# Altium schematic sheet LPCB278 - RELAYS.SchDoc
size A3; Address1: Factory 10; Address2: 9-13 Dingley Avenue, Dandeong, VICTORIA 3175, AUSTRALIA; DocumentNumber: 4; Revision: 1; SheetNumber: 4; SheetTotal: 5; Lockie__PCB_SUB_ASSEMBLY: PCB Sub Component; Lockie__PCB_ASSEMBLY: PCB Assembly; Lockie__LDL: LPCB278; Lockie__PCB_DESCRIPTION: HE Thermal Module
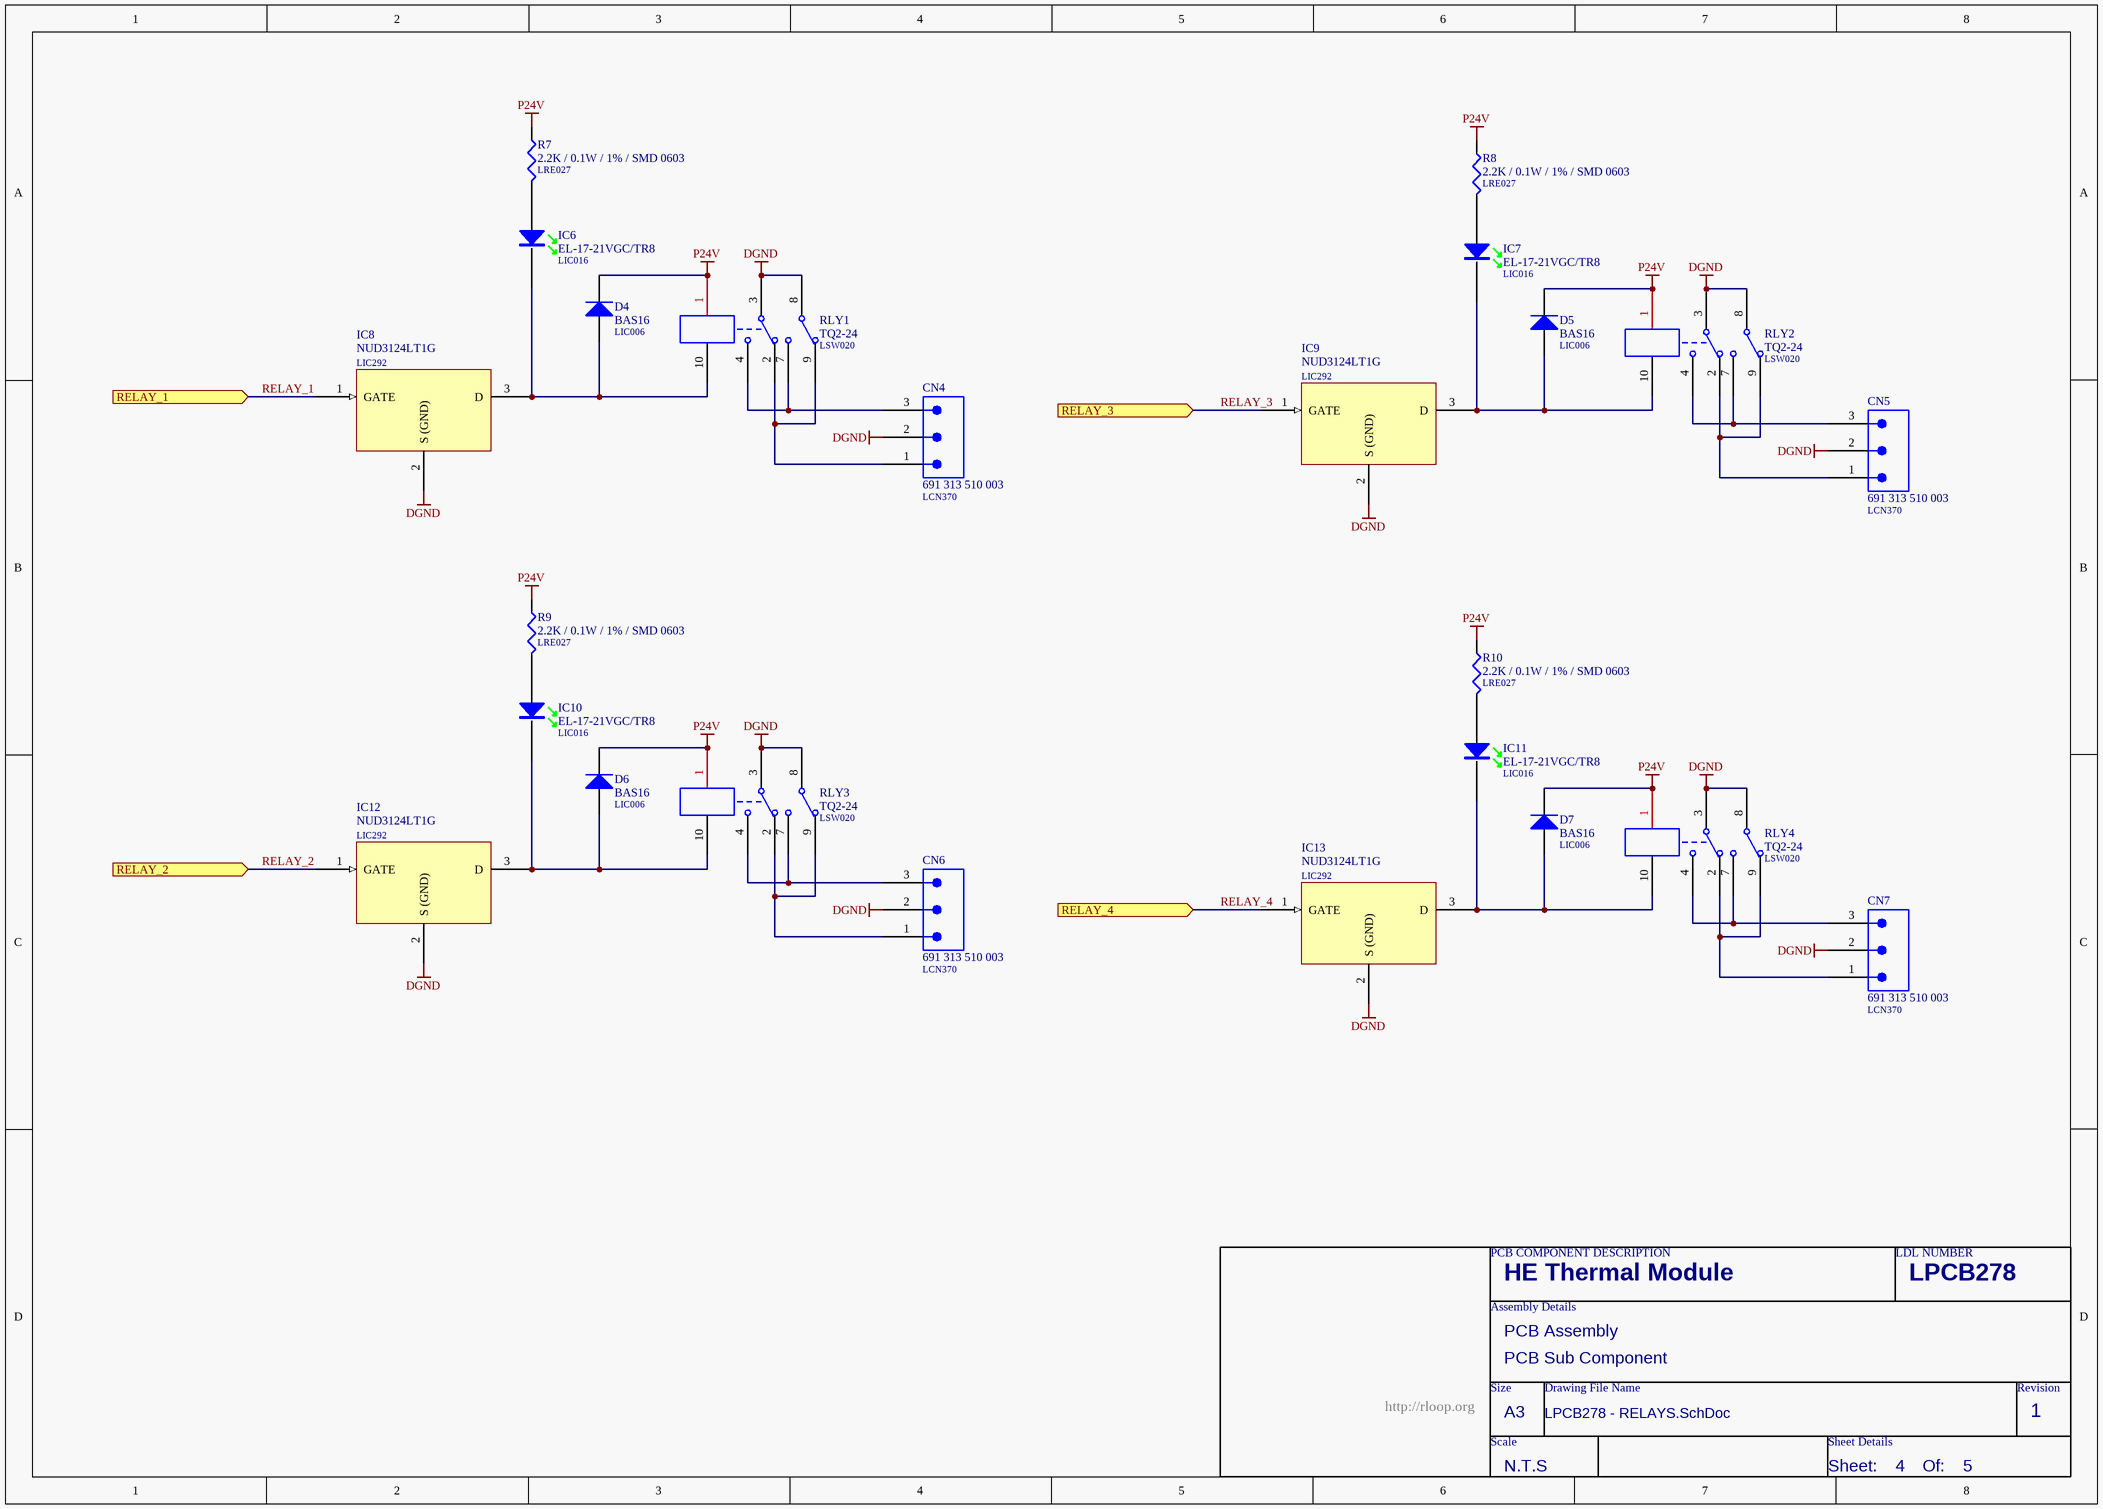
[diagram p0: LPCB278 - RELAYS.SchDoc]

## Parts
CN4  691 313 510 003  LDL_NUMBER: LCN370  [691 313 510 003]
CN5  691 313 510 003  LDL_NUMBER: LCN370  [691 313 510 003]
CN6  691 313 510 003  LDL_NUMBER: LCN370  [691 313 510 003]
CN7  691 313 510 003  LDL_NUMBER: LCN370  [691 313 510 003]
D4  BAS16  LDL_NUMBER: LIC006  [LFP021__SOT23]
D5  BAS16  LDL_NUMBER: LIC006  [LFP021__SOT23]
D6  BAS16  LDL_NUMBER: LIC006  [LFP021__SOT23]
D7  BAS16  LDL_NUMBER: LIC006  [LFP021__SOT23]
IC6  EL-17-21VGC/TR8  LDL_NUMBER: LIC016  [CR2012-0805-LED]
IC7  EL-17-21VGC/TR8  LDL_NUMBER: LIC016  [CR2012-0805-LED]
IC8  NUD3124LT1G  LDL_NUMBER: LIC292  [LFP021__SOT23]
IC9  NUD3124LT1G  LDL_NUMBER: LIC292  [LFP021__SOT23]
IC10  EL-17-21VGC/TR8  LDL_NUMBER: LIC016  [CR2012-0805-LED]
IC11  EL-17-21VGC/TR8  LDL_NUMBER: LIC016  [CR2012-0805-LED]
IC12  NUD3124LT1G  LDL_NUMBER: LIC292  [LFP021__SOT23]
IC13  NUD3124LT1G  LDL_NUMBER: LIC292  [LFP021__SOT23]
R7  2.2K / 0.1W / 1% / SMD 0603  LDL_NUMBER: LRE027  [LFP020__CR1608-0603-IPC7351_B]
R8  2.2K / 0.1W / 1% / SMD 0603  LDL_NUMBER: LRE027  [LFP020__CR1608-0603-IPC7351_B]
R9  2.2K / 0.1W / 1% / SMD 0603  LDL_NUMBER: LRE027  [LFP020__CR1608-0603-IPC7351_B]
R10  2.2K / 0.1W / 1% / SMD 0603  LDL_NUMBER: LRE027  [LFP020__CR1608-0603-IPC7351_B]
RLY1  TQ2-24  LDL_NUMBER: LSW020  [TQ2]
RLY2  TQ2-24  LDL_NUMBER: LSW020  [TQ2]
RLY3  TQ2-24  LDL_NUMBER: LSW020  [TQ2]
RLY4  TQ2-24  LDL_NUMBER: LSW020  [TQ2]

## Ports
RELAY_1 (in), RELAY_2 (in), RELAY_3 (in), RELAY_4 (in)

## Nets
DGND: CN4.2 CN5.2 CN6.2 CN7.2 IC8.2(S_(GND)) IC9.2(S_(GND)) IC12.2(S_(GND)) IC13.2(S_(GND)) RLY1.3 RLY1.8 RLY2.3 RLY2.8 RLY3.3 RLY3.8 RLY4.3 RLY4.8
P24V: D4.3(K) D5.3(K) D6.3(K) D7.3(K) R7.1 R8.1 R9.1 R10.1 RLY1.1 RLY2.1 RLY3.1 RLY4.1
RELAY_1: IC8.1(GATE) ; port RELAY_1
RELAY_2: IC12.1(GATE) ; port RELAY_2
RELAY_3: IC9.1(GATE) ; port RELAY_3
RELAY_4: IC13.1(GATE) ; port RELAY_4
NetCN4_1: CN4.1 RLY1.2 RLY1.9
NetCN4_3: CN4.3 RLY1.4 RLY1.7
NetCN5_1: CN5.1 RLY2.2 RLY2.9
NetCN5_3: CN5.3 RLY2.4 RLY2.7
NetCN6_1: CN6.1 RLY3.2 RLY3.9
NetCN6_3: CN6.3 RLY3.4 RLY3.7
NetCN7_1: CN7.1 RLY4.2 RLY4.9
NetCN7_3: CN7.3 RLY4.4 RLY4.7
NetD4_1: D4.1(A) IC6.K IC8.3(D) RLY1.10
NetD5_1: D5.1(A) IC7.K IC9.3(D) RLY2.10
NetD6_1: D6.1(A) IC10.K IC12.3(D) RLY3.10
NetD7_1: D7.1(A) IC11.K IC13.3(D) RLY4.10
NetIC6_A: IC6.A R7.2
NetIC7_A: IC7.A R8.2
NetIC10_A: IC10.A R9.2
NetIC11_A: IC11.A R10.2

## Notes on the sheet
- PCB COMPONENT DESCRIPTION
- LDL NUMBER
- Assembly Details
- Size
- Drawing File Name
- Revision
- http://rloop.org
- Scale
- A3
- Sheet Details
- N.T.S
- Sheet:
- Of:

## Library data of the parts
CN4-CN7 = 691 313 510 003: Connector, Pluggable Terminal Block, 5.08mm, 3 Way, PTH; FMEDA__CHANNEL: COM; FMEDA__OPERATING__CURRENT_MAX: 0; FMEDA__OPERATING__TEMP_MAX: 50; FMEDA__OPERATING__TEMP_MIN: -20; FMEDA__OPERATING__TEMP_TYP: 27; FMEDA__OPERATING__VOLTAGE_MAX: 16; FMEDA__OPERATING__VOLTAGE_TYP: 12; FMEDA__FUNCTION_IN_SYSTEM: *; FMEDA__OPERATING__CURRENT_MIN: 0; FMEDA__OPERATING__CURRENT_TYP: 0; FMEDA__OPERATING__VOLTAGE_MIN: 0
D4-D7 = BAS16: Diode, Small Signal, 0.2A, 85V, SMD SOT-23 [LIC006]; FMEDA__OPERATING__CURRENT_MIN: 0; FMEDA__OPERATING__TEMP_MIN: -20; FMEDA__OPERATING__TEMP_TYP: 27; FMEDA__OPERATING__TEMP_MAX: 50; FMEDA__CHANNEL: COM; FMEDA__OPERATING__CURRENT_MAX: 0; FMEDA__OPERATING__VOLTAGE_MIN: 0; FMEDA__OPERATING__VOLTAGE_MAX: 0; FMEDA__FUNCTION_IN_SYSTEM: *; FMEDA__OPERATING__CURRENT_TYP: 0; FMEDA__OPERATING__VOLTAGE_TYP: 0
IC6 IC7 IC10 IC11 = EL-17-21VGC/TR8: LED, SMD, 0805 Green [LIC016]; FMEDA__OPERATING__TEMP_MAX: 50; FMEDA__OPERATING__TEMP_MIN: -20; FMEDA__OPERATING__TEMP_TYP: 27; FMEDA__CHANNEL: COM; FMEDA__FUNCTION_IN_SYSTEM: *
IC8 IC9 IC12 IC13 = NUD3124LT1G: IC, Relay Driver, 28V Industrial, SMD SOT23 [LIC292]; FMEDA__OPERATING__TEMP_MIN: -20; FMEDA__OPERATING__TEMP_TYP: 27; FMEDA__OPERATING__TEMP_MAX: 50; FMEDA__OPERATING__VOLTAGE_MIN: 0; FMEDA__OPERATING__VOLTAGE_TYP: 13; FMEDA__OPERATING__VOLTAGE_MAX: 18; FMEDA__OPERATING__POWER_TYP: 0.1; FMEDA__OPERATING__POWER_MAX: 0.15; FMEDA__CHANNEL: COM; FMEDA__FUNCTION_IN_SYSTEM: *; FMEDA__OPERATING__POWER_MIN: 0
R7-R10 = 2.2K / 0.1W / 1% / SMD 0603: Resistor, Ceramic Chip, 2.2K, 0.1W, 1%, SMD 0603 [LRE027]; FMEDA__OPERATING__VOLTAGE_MIN: 0; FMEDA__OPERATING__TEMP_MIN: -20; FMEDA__OPERATING__TEMP_TYP: 27; FMEDA__OPERATING__TEMP_MAX: 50; FMEDA__CHANNEL: COM; VALUE: 2.2K; FMEDA__OPERATING__VOLTAGE_MAX: 0; FMEDA__OPERATING__POWER_MIN: 0; FMEDA__OPERATING__POWER_MAX: 0; FMEDA__FUNCTION_IN_SYSTEM: *; FMEDA__OPERATING__VOLTAGE_TYP: 0
RLY1-RLY4 = TQ2-24: Relay, DPDT, Non Latching, 24VDC Coil, 1A Rating, PTH; FMEDA__CHANNEL: COM; FMEDA__OPERATING__TEMP_MAX: 50; FMEDA__OPERATING__TEMP_MIN: -20; FMEDA__OPERATING__TEMP_TYP: 27; Revision: July-2002: Re-released for DXP Platform.; FMEDA__FUNCTION_IN_SYSTEM: *